# Altium schematic sheet Fri3D_2020_Doodles.SchDoc: Doodles
size A3; Date: 21/02/2020; DrawnBy: Wim Van Gool; DocumentNumber: 5; Revision: 00; SheetNumber: 5; SheetTotal: 5
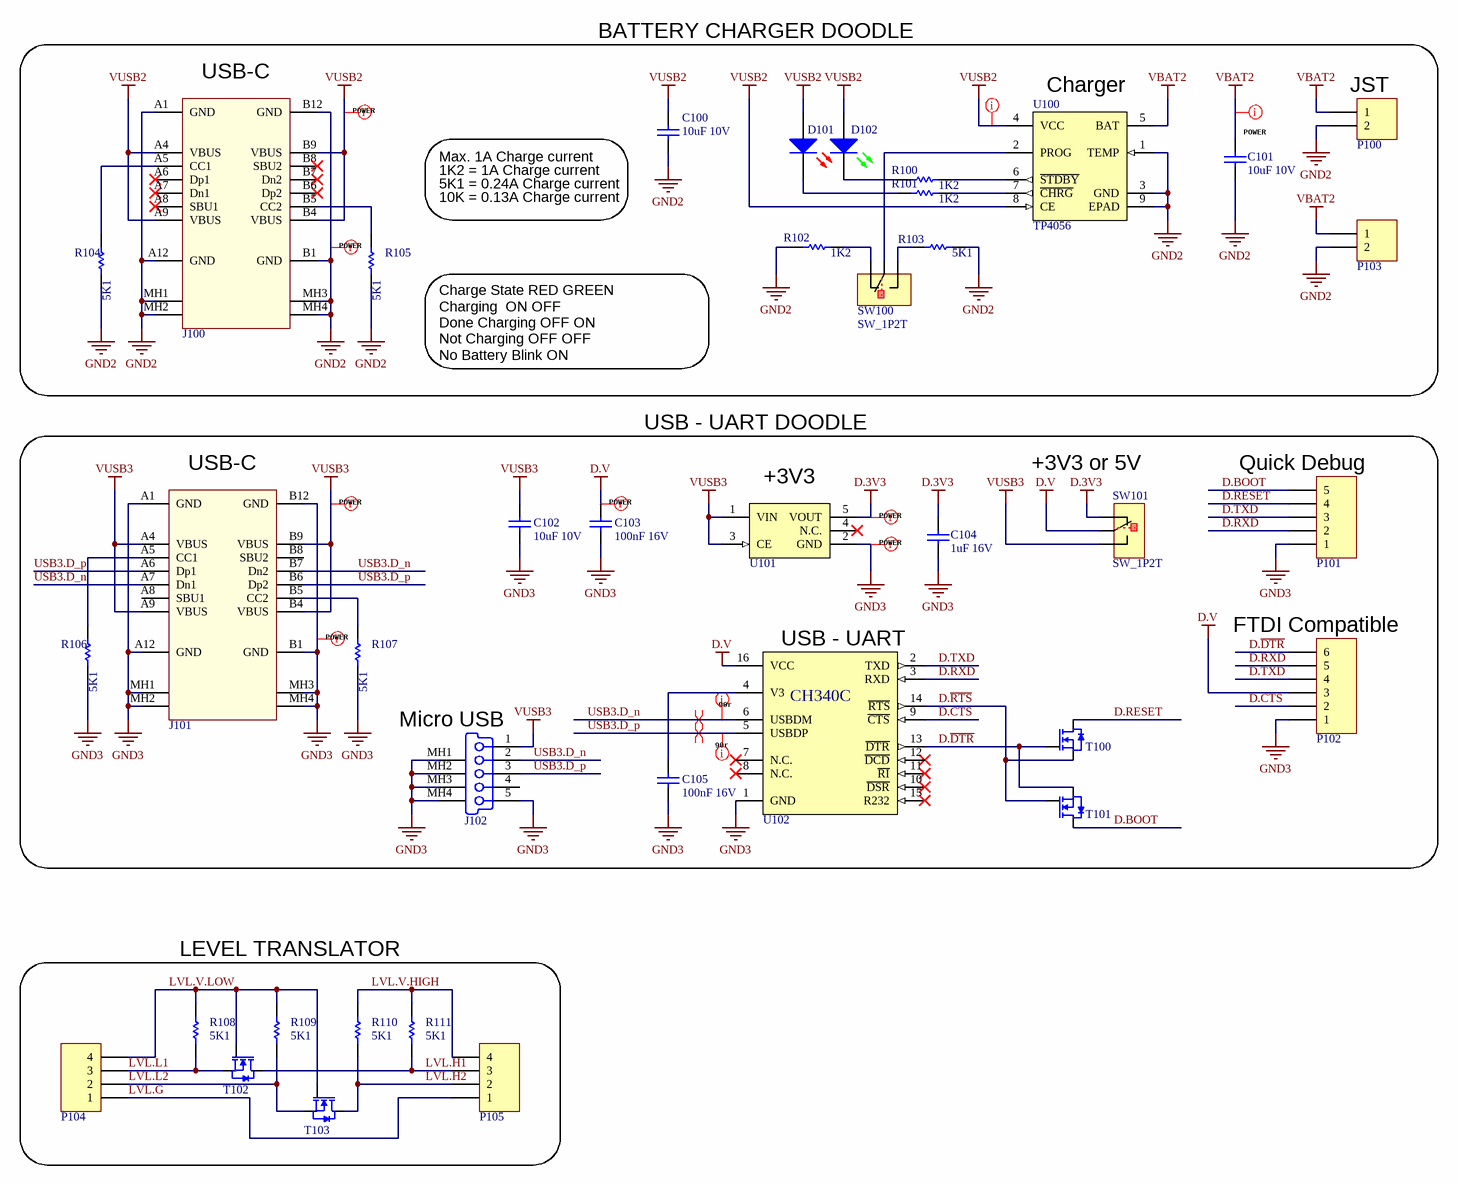
[diagram p0: Fri3D_2020_Doodles.SchDoc]

## Parts
C100  value 10uF 10V  [C0805_N]  (hidden comment: CAP_CERAMIC)
C101  value 10uF 10V  [C0805_N]  (hidden comment: CAP_CERAMIC)
C102  value 10uF 10V  [C0805_N]  (hidden comment: CAP_CERAMIC)
C103  value 100nF 16V  [C0603_N]
C104  value 1uF 16V  [C0603_N]  (hidden comment: CAP_CERAMIC)
C105  value 100nF 16V  [C0603_N]
D101  Default 0805 Red LED  [LED_0805_RD]  (value not drawn)
D102  Default 0805 Green LED  [LED_0805_GR]  (value not drawn)
J100  USB 2.0 C Reversible Receptacle Horizontal  [HRO_TYPE-C-31-M-12]  (value not drawn)
J101  USB 2.0 C Reversible Receptacle Horizontal  [HRO_TYPE-C-31-M-12]  (value not drawn)
J102  XKB U254-051T-4BH81-S2S Micro USB  [XKB_U254-051T-4BH81-S2S]  (value not drawn)
P100  Header 2.0mm Shrouded 2  [WE_620102131822]  (value not drawn)
P101  Header 1.0mm RA Shrouded 5  [WE_665105131822]  (value not drawn)
P102  Header 6  [HDR1X6]  (value not drawn)
P103  Header 2  [HDR1X2]  (value not drawn)
P104  Header 4  [HDR1X4]  (value not drawn)
P105  Header 4  [HDR1X4]  (value not drawn)
R100  value 1K2  [R0603_N]  (hidden comment: RESISTOR)
R101  value 1K2  [R0603_N]  (hidden comment: RESISTOR)
R102  value 1K2  [R0603_N]  (hidden comment: RESISTOR)
R103  value 5K1  [R0603_N]  (hidden comment: RESISTOR)
R104  value 5K1  [R0603_N]  (hidden comment: RESISTOR)
R105  value 5K1  [R0603_N]  (hidden comment: RESISTOR)
R106  value 5K1  [R0603_N]  (hidden comment: RESISTOR)
R107  value 5K1  [R0603_N]  (hidden comment: RESISTOR)
R108  value 5K1  [R0603_N]  (hidden comment: RESISTOR)
R109  value 5K1  [R0603_N]  (hidden comment: RESISTOR)
R110  value 5K1  [R0603_N]  (hidden comment: RESISTOR)
R111  value 5K1  [R0603_N]  (hidden comment: RESISTOR)
SW100  SW_1P2T  [WE_450404015514]
SW101  SW_1P2T  [WE_450404015514]
T100  0.2A N-Ch MOSFET Vgs 3.2  [SOT23-3]  (value not drawn)
T101  0.2A N-Ch MOSFET Vgs 3.2  [SOT23-3]  (value not drawn)
T102  0.2A N-Ch MOSFET Vgs 3.2  [SOT23-3]  (value not drawn)
T103  0.2A N-Ch MOSFET Vgs 3.2  [SOT23-3]  (value not drawn)
U100  value TP4056  [SOIC_N_8_TH]  (hidden comment: Single Cell LiIon charger max 1A)
U101  3V3 LDO 700mA 50mV  [SOT23-5]  (value not drawn)
U102  USB to full UART with internal crystal  [SOIC_N_16]  (value not drawn)

## Blocks framed on the sheet
LEVEL TRANSLATOR: P104 P105 R108-R111 T102 T103

## Nets
D.3V3: C104.1 SW101.1 U101.5(VOUT)
D.V: C103.1 P102.3 SW101.2 U102.16(VCC)
GND2: C100.2 C101.2 J100.A1(GND) J100.A12(GND) J100.B1(GND) J100.B12(GND) J100.MH1(Tab) J100.MH2(Tab) J100.MH3(Tab) J100.MH4(Tab) P100.2 P103.2 R102.2 R103.2 R104.2 R105.2 U100.1(TEMP) U100.3(GND) U100.9(EPAD)
GND3: C102.2 C103.2 C104.2 C105.2 J101.A1(GND) J101.A12(GND) J101.B1(GND) J101.B12(GND) J101.MH1(Tab) J101.MH2(Tab) J101.MH3(Tab) J101.MH4(Tab) J102.5(GND) J102.MH1(Tab) J102.MH2(Tab) J102.MH3(Tab) J102.MH4(Tab) P101.1 P102.1 R106.2 R107.2 U101.2(GND) U102.1(GND)
VBAT2: C101.1 P100.1 P103.1 U100.5(BAT)
VUSB2: C100.1 D101.1(A) D102.1(A) J100.A4(VBUS) J100.A9(VBUS) J100.B4(VBUS) J100.B9(VBUS) U100.4(VCC) U100.8(CE)
VUSB3: C102.1 J101.A4(VBUS) J101.A9(VBUS) J101.B4(VBUS) J101.B9(VBUS) J102.1(V_BUS_(5V)) SW101.3 U101.1(VIN) U101.3(CE)
D.BOOT: P101.5 T101.3(D)
D.~{CTS}: P102.2 U102.9(~{CTS})
D.~{DTR}: P102.6 T100.1(G) T101.2(S) U102.13(~{DTR})
D.~{RTS}: T100.2(S) T101.1(G) U102.14(~{RTS})
D.RESET: P101.4 T100.3(D)
D.RXD: P101.2 P102.5 U102.3(RXD)
D.TXD: P101.3 P102.4 U102.2(TXD)
LVL.G: P104.1 P105.1
LVL.H1: P105.3 R111.2 T102.3(D)
LVL.H2: P105.2 R110.2 T103.3(D)
LVL.L1: P104.3 R108.2 T102.2(S)
LVL.L2: P104.2 R109.2 T103.2(S)
LVL.V.HIGH: P105.4 R110.1 R111.1
LVL.V.LOW: P104.4 R108.1 R109.1 T102.1(G) T103.1(G)
USB3.D_n: J101.A7(Dn1) J101.B7(Dn2) J102.2(D-) U102.6(USBDM)
USB3.D_p: J101.A6(Dp1) J101.B6(Dp2) J102.3(D+) U102.5(USBDP)
NetC105_1: C105.1 U102.4(V3)
NetD101_2: D101.2(K) R101.1
NetD102_2: D102.2(K) R100.1
NetJ100_A5: J100.A5(CC1) R104.1
NetJ100_B5: J100.B5(CC2) R105.1
NetJ101_A5: J101.A5(CC1) R106.1
NetJ101_B5: J101.B5(CC2) R107.1
NetR100_2: R100.2 U100.6(~{STDBY})
NetR101_2: R101.2 U100.7(~{CHRG})
NetR102_1: R102.1 SW100.1
NetR103_1: R103.1 SW100.3
NetSW100_2: SW100.2 U100.2(PROG)

Not connected (* = marked no-connect by the designer): J100 A6(Dp1)* A7(Dn1)* A8(SBU1)* B6(Dp2)* B7(Dn2)* B8(SBU2)*; J101 A8(SBU1) B8(SBU2); J102 4(NC); U101 4(N.C.)*; U102 7(N.C.)* 8(N.C.)* 10(~{DSR})* 11(~{RI})* 12(~{DCD})* 15(R232)*

## Layout directives
net class POWER: D.3V3, D.V, GND2, GND3, VBAT2, VUSB2, VUSB3
net class 90r: USB3.D_n, USB3.D_p
differential pair: USB3.D_n, USB3.D_p

## Notes on the sheet
- (near J100) USB-C
- BATTERY CHARGER DOODLE
- (near U100) Charger
- (near P100) JST
- Max. 1A Charge current
- 1K2 = 1A Charge current
- 5K1 = 0.24A Charge current
- 10K = 0.13A Charge current
- Charge State	RED	GREEN
  Charging		ON	OFF
  Done Charging	OFF	ON
  Not Charging	OFF	OFF
  No Battery	Blink	ON
- USB - UART DOODLE
- (near J101) USB-C
- (near U101) +3V3
- (near SW101) +3V3 or 5V
- (near P101) Quick Debug
- (near P102) FTDI Compatible
- (near U102) USB - UART
- (near J102) Micro USB
- Title
- Revision
- Date
- Dranw By
- Size
- A3
- Sheet
- of

## Library data of the parts
C100-C102 = CAP # 10uF 10V 0805: Capacitor Ceramic; Supplier 1: Farnell; Supplier Part Number 1: 2320859
C103 C105 = CAP # 100nF 16V 0603: Capacitor Ceramic
C104 = CAP # 1uF 16V 0603: Capacitor Ceramic; Supplier 1: Farnell; Supplier Part Number 1: 2320814
D101 = LED # Red 0805: =Description; Supplier 1: Farnell; Supplier Part Number 1: 2099236
D102 = LED # Green 0805: =Description; Supplier 1: Farnell; Supplier Part Number 1: 2099239
J100 J101 = USB # C 2.0 RCPT TYPE-C-31-M-12: Value: TYPE-C-31-M-12; Supplier 1: China; Supplier Part Number 1: HRO TYPE-C-31-M-12; Supplier 2: LCSC; Supplier Part Number 2: C165948; Supplier 3: LCSC ALT; Supplier Part Number 3: C167321 / C319148
J102 = USB # Micro B TH XKB U254-051T-4BH81-S2S: Value: U254-051T-4BH81-S2S; Supplier 1: LCSC; Supplier Part Number 1: C381144
P100 = HDR # SHR 2.0mm 2way - 620102131822: Value: 620102131822; Supplier 1: Wurth
P101 = HDR # RA SHR 1.0mm 5way - 665105131822: Value: 665105131822; Supplier 1: Wurth; Supplier Part Number 1: 665105131822; Supplier 2: Mouser; Supplier Part Number 2: 710-665105131822
P102 = Pin Header 2.54mm 6way
P103 = Pin Header 2.54mm 2way
P104 P105 = Pin Header 2.54mm 4way
R100-R102 = RES # 1K2 0603
R103-R111 = RES # 5K1 0603: Supplier 1: Farnell; Supplier Part Number 1: 2845922
SW100 SW101 = SW # 1P2T WS-SLSU mini slide 6,7 x 2,7 mm
T100-T103 = BSS138 N-Ch MOSFET 0.2A 3.2Vgs 60Vds: Value: BSS138; Supplier 1: Farnell; Supplier Part Number 1: 2432717
U100 = CHG # TP4056 LiIon 1A: =Description; Supplier 1: Aliexpress; Supplier Part Number 1: TP4056
U101 = LDO # 3V3 XC6210B33: =Designator; Value: XC6210B332MR; Supplier 1: Farnell; Supplier Part Number 1: 1057803
U102 = CH340C # UCB UART: =Description; Value: CH340C; Supplier 1: LCSC; Supplier Part Number 1: C84681